# EAGLE board board (EAGLE 6.5.0)
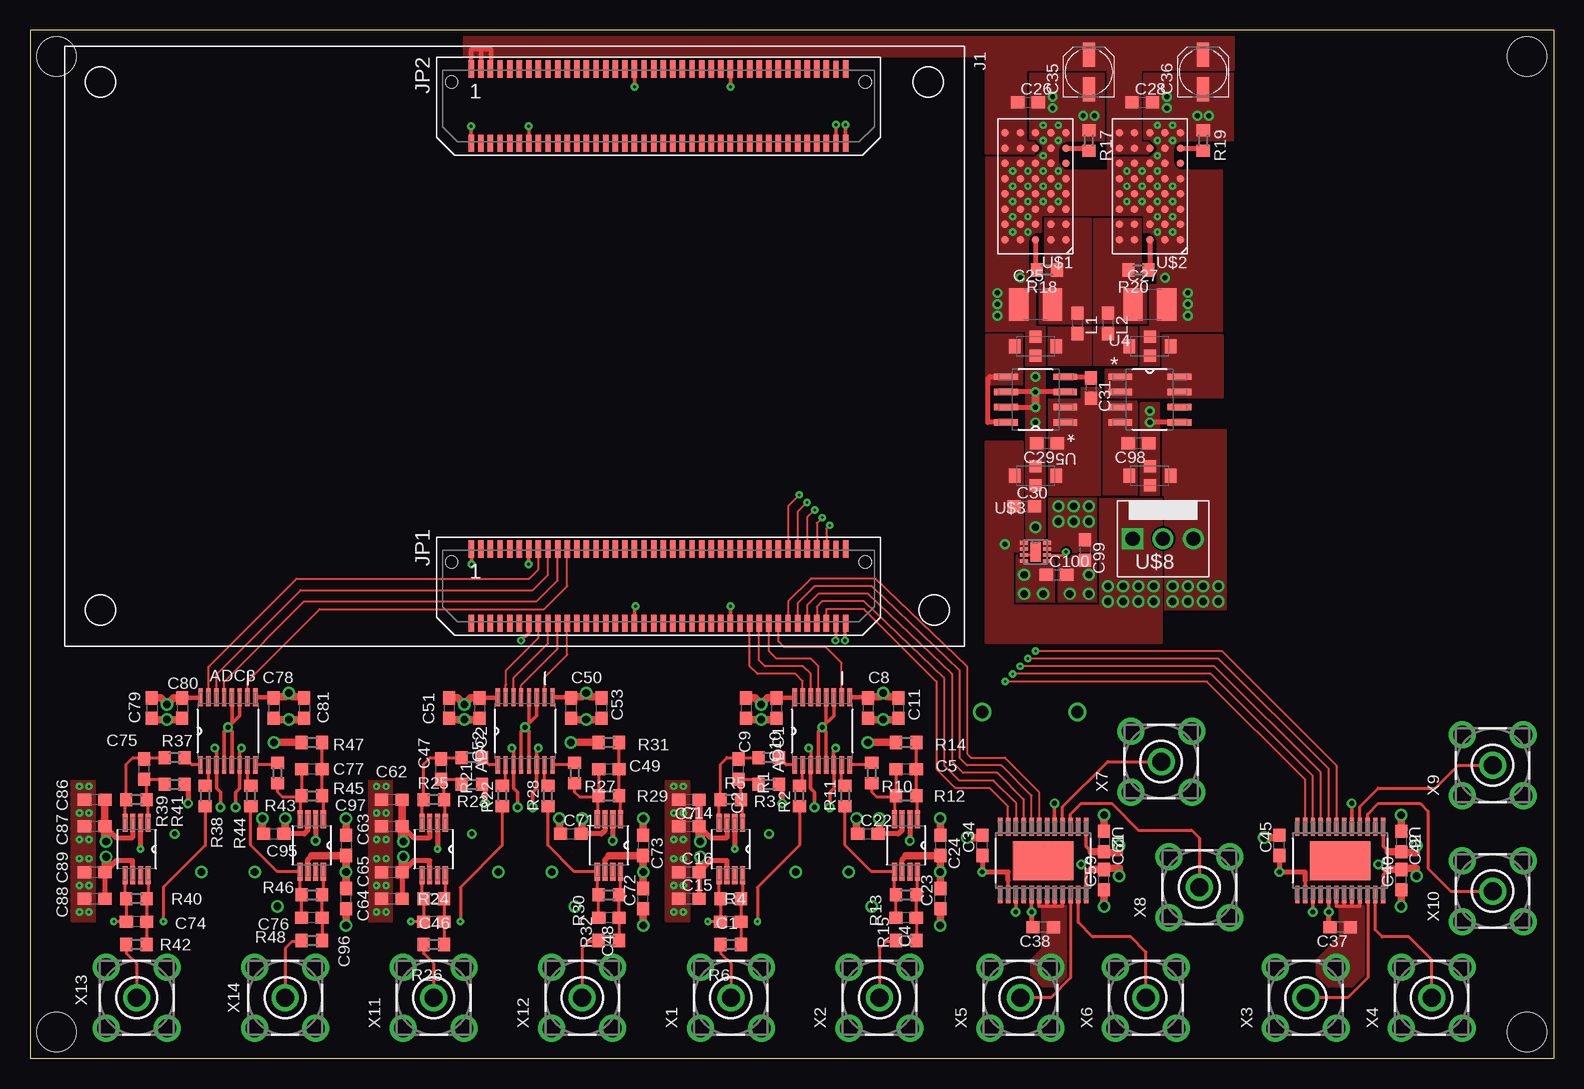
[diagram p4: board, top side]
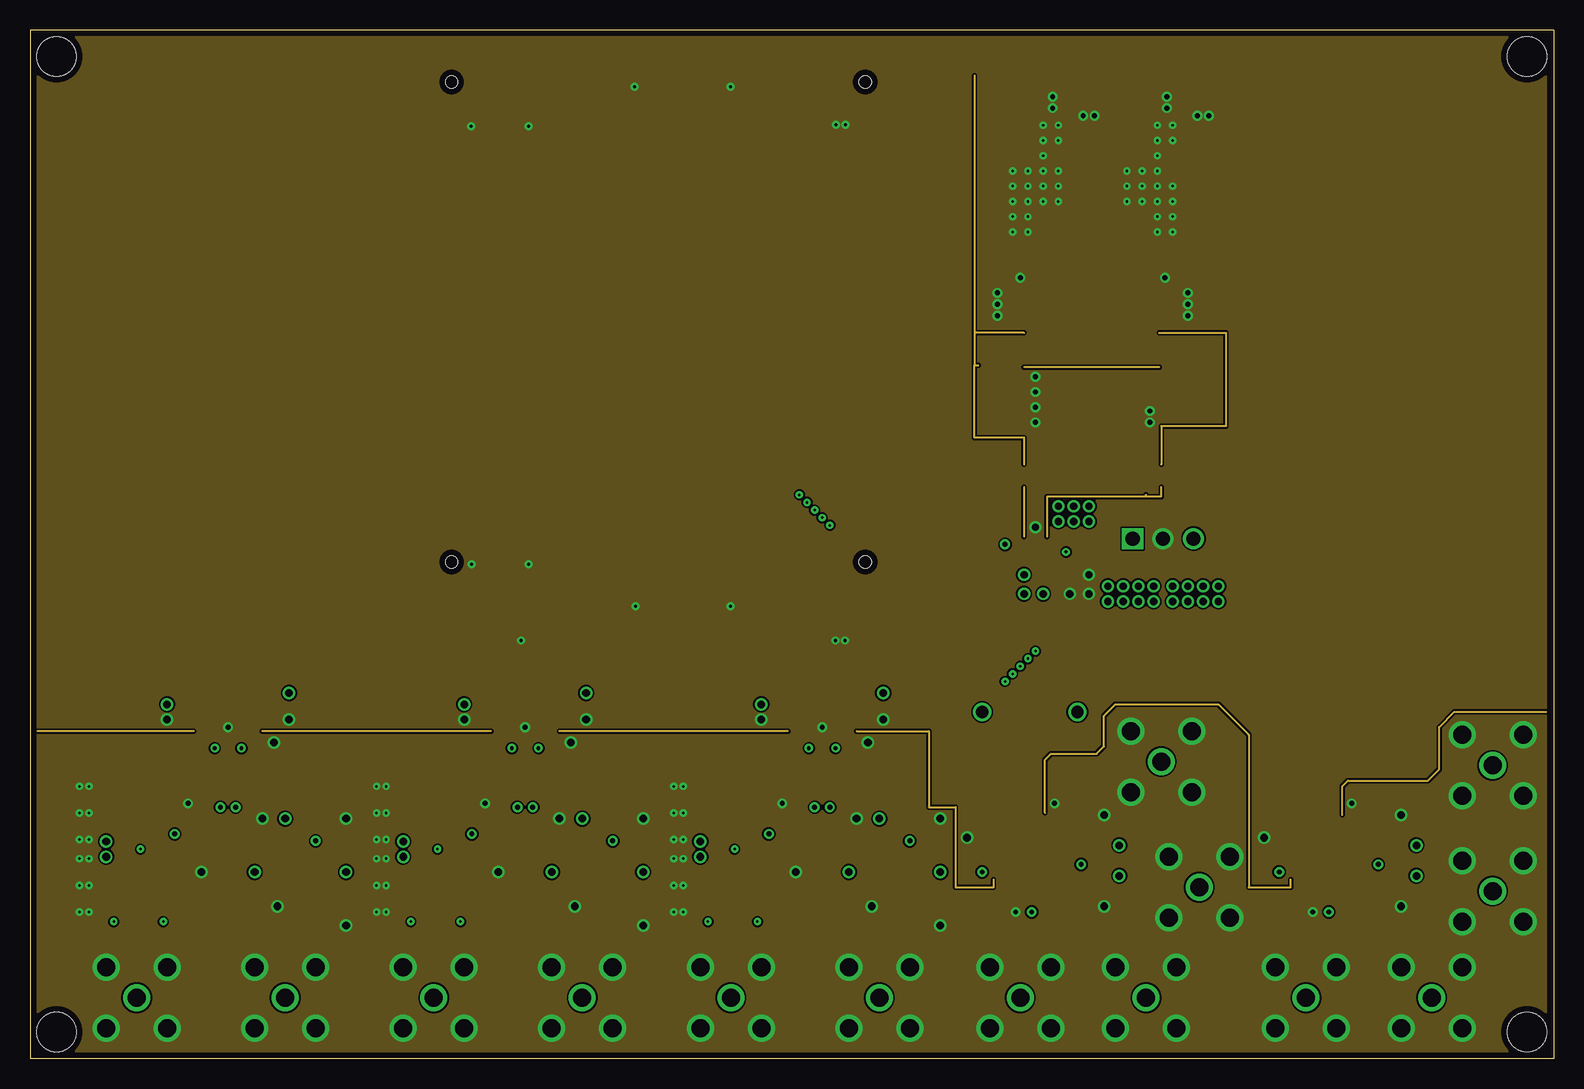
[diagram p5: board, inner layer $GND]
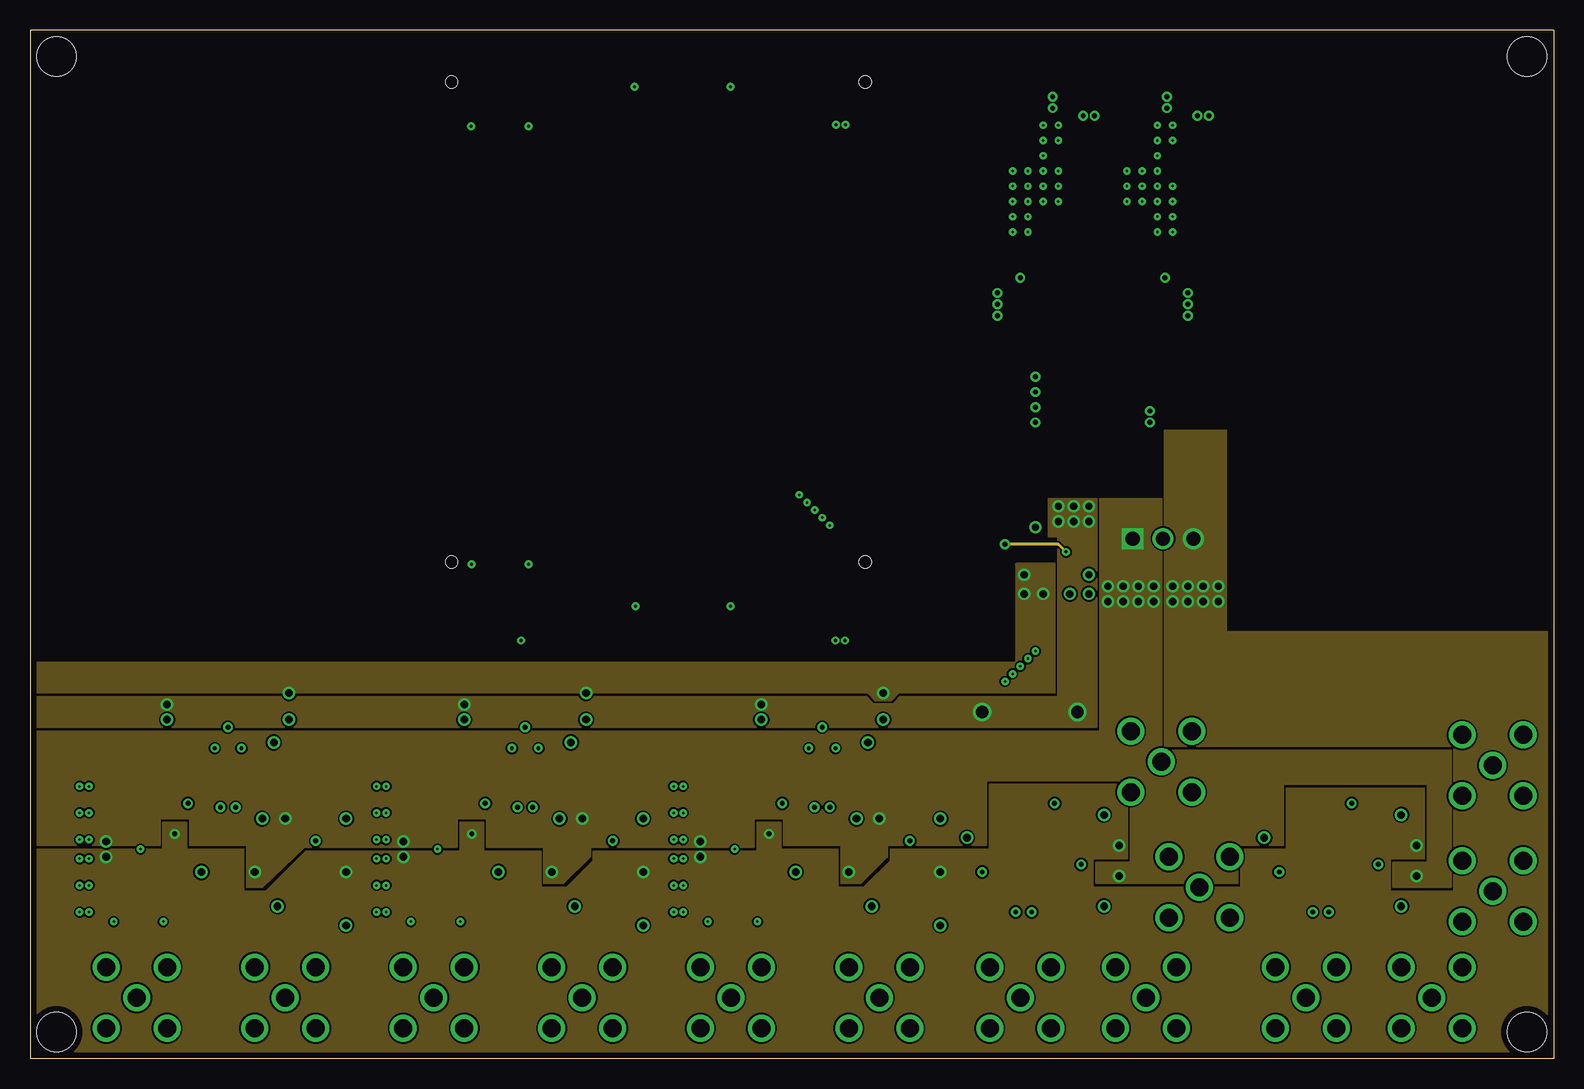
[diagram p6: board, inner layer Route15]
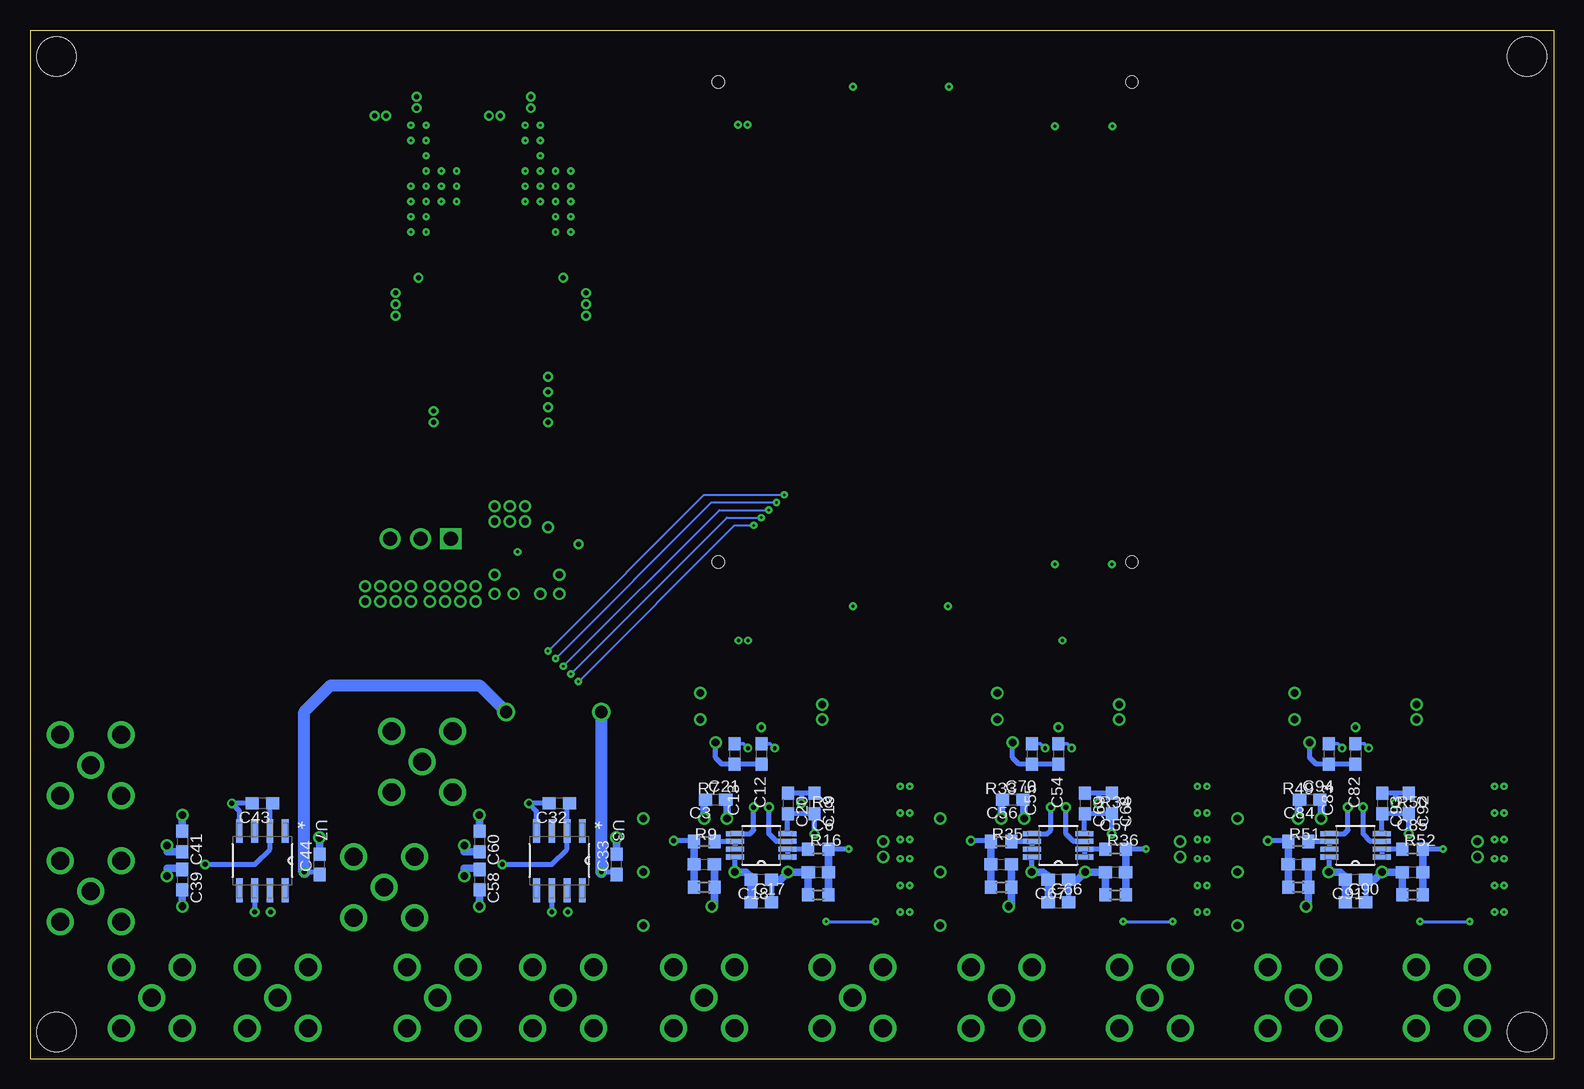
[diagram p7: board, bottom side, seen from below]

Size 127 x 85.72 mm. Coordinates in mm from the lower left corner, seen from the top.
Outline: 127,85.72 0,85.72 0,0 127,0 127,85.72
Copper layers (1+2*15+16): Top 0.0178mm / dielectric 12mil / $GND 0.0356mm / dielectric 28mil / Route15 0.0356mm / dielectric 12mil / Bottom 0.0178mm
Design rules "SSC-EAGLE-4Lyr_v1.0.0.3 *": minimum track width 6mil, minimum drill 8mil, track to track 6mil, track to pad 6mil, pad to pad 6mil, via to via 6mil, smd to smd 6mil, copper to edge 20mil, drill to drill 16mil, minimum pad ring 8mil, minimum via ring 8mil, stop-mask expansion 3mil, vias tented up to drill 0mil, thermal gap 0mil
Holes 3.26 mm at 124.78,2.22 124.78,83.5 2.22,83.5 2.22,2.22

## Footprints (pad centres in the part's own frame; a part is rotated, then mirrored left to right if it is on the bottom)
SOP65P640X120-16N = smd 1.473 x 0.356: 1 -2.819,2.286; 2 -2.819,1.626; 3 -2.819,0.965; 4 -2.819,0.33; 5 -2.819,-0.33; 6 -2.819,-0.965; 7 -2.819,-1.626; 8 -2.819,-2.286; 9 2.819,-2.286; 10 2.819,-1.626; 11 2.819,-0.965; 12 2.819,-0.33; 13 2.819,0.33; 14 2.819,0.965; 15 2.819,1.626; 16 2.819,2.286
SOP65P490X110-8N = smd 1.499 x 0.432: 1 -2.184,0.965; 2 -2.184,0.33; 3 -2.184,-0.33; 4 -2.184,-0.965; 5 2.184,-0.965; 6 2.184,-0.33; 7 2.184,0.33; 8 2.184,0.965
C0603 = smd 1.1 x 1: 1 -0.85,0; 2 0.85,0
C0603T = smd 1.1 x 1: + -0.85,0; - 0.85,0
C1210 = smd 1.6 x 2.7: 1 -1.4,0; 2 1.4,0
UD-4X5,8_NICHICON = smd 2 x 1: + 1.425,0; - -1.425,0
XEM6310 = smd 1.448 x 0.457: 101 -23.09,-15.6; 102 -16.92,-15.6; 103 -23.09,-14.8; 104 -16.92,-14.8; 105 -23.09,-14; 106 -16.92,-14; 107 -23.09,-13.2; 108 -16.92,-13.2; 109 -23.09,-12.4; 110 -16.92,-12.4; 111 -23.09,-11.6; 112 -16.92,-11.6; 113 -23.09,-10.8; 114 -16.92,-10.8; 115 -23.09,-10; 116 -16.92,-10; 117 -23.09,-9.2; 118 -16.92,-9.2; 119 -23.09,-8.4; 120 -16.92,-8.4; 121 -23.09,-7.6; 122 -16.92,-7.6; 123 -23.09,-6.8; 124 -16.92,-6.8; 125 -23.09,-6; 126 -16.92,-6; 127 -23.09,-5.2; 128 -16.92,-5.2; 129 -23.09,-4.4; 130 -16.92,-4.4; 131 -23.09,-3.6; 132 -16.92,-3.6; 133 -23.09,-2.8; 134 -16.92,-2.8; 135 -23.09,-2; 136 -16.92,-2; 137 -23.09,-1.2; 138 -16.92,-1.2; 139 -23.09,-0.4; 140 -16.92,-0.4; 141 -23.09,0.4; 142 -16.92,0.4; 143 -23.09,1.2; 144 -16.92,1.2; 145 -23.09,2; 146 -16.92,2; 147 -23.09,2.8; 148 -16.92,2.8; 149 -23.09,3.6; 150 -16.92,3.6; 151 -23.09,4.4; 152 -16.92,4.4; 153 -23.09,5.2; 154 -16.92,5.2; 155 -23.09,6; 156 -16.92,6; 157 -23.09,6.8; 158 -16.92,6.8; 159 -23.09,7.6; 160 -16.92,7.6; 161 -23.09,8.4; 162 -16.92,8.4; 163 -23.09,9.2; 164 -16.92,9.2; 165 -23.09,10; 166 -16.92,10; 167 -23.09,10.8; 168 -16.92,10.8; 169 -23.09,11.6; 170 -16.92,11.6; 171 -23.09,12.4; 172 -16.92,12.4; 173 -23.09,13.2; 174 -16.92,13.2; 175 -23.09,14; 176 -16.92,14; 177 -23.086,14.8; 178 -16.92,14.8; 179 -23.09,15.6; 180 -16.92,15.6; 201 16.91,-15.6; 202 23.08,-15.6; 203 16.91,-14.8; 204 23.08,-14.8; 205 16.91,-14; 206 23.08,-14; 207 16.91,-13.2; 208 23.08,-13.2; 209 16.91,-12.4; 210 23.08,-12.4; 211 16.91,-11.6; 212 23.08,-11.6; 213 16.91,-10.8; 214 23.08,-10.8; 215 16.91,-10; 216 23.08,-10; 217 16.91,-9.2; 218 23.08,-9.2; 219 16.91,-8.4; 220 23.08,-8.4; 221 16.91,-7.6; 222 23.08,-7.6; 223 16.91,-6.8; 224 23.08,-6.8; 225 16.91,-6; 226 23.08,-6; 227 16.91,-5.2; 228 23.08,-5.2; 229 16.91,-4.4; 230 23.08,-4.4; 231 16.91,-3.6; 232 23.08,-3.6; 233 16.91,-2.8; 234 23.08,-2.8; 235 16.91,-2; 236 23.08,-2; 237 16.91,-1.2; 238 23.08,-1.2; 239 16.91,-0.4; 240 23.08,-0.4; 241 16.91,0.4; 242 23.08,0.4; 243 16.91,1.2; 244 23.08,1.2; 245 16.91,2; 246 23.08,2; 247 16.91,2.8; 248 23.08,2.8; 249 16.91,3.6; 250 23.08,3.6; 251 16.91,4.4; 252 23.08,4.4; 253 16.91,5.2; 254 23.08,5.2; 255 16.91,6; 256 23.08,6; 257 16.91,6.8; 258 23.08,6.8; 259 16.91,7.6; 260 23.08,7.6; 261 16.91,8.4; 262 23.08,8.4; 263 16.91,9.2; 264 23.08,9.2; 265 16.91,10; 266 23.08,10; 267 16.91,10.8; 268 23.08,10.8; 269 16.91,11.6; 270 23.08,11.6; 271 16.91,12.4; 272 23.08,12.4; 273 16.91,13.2; 274 23.08,13.2; 275 16.91,14; 276 23.08,14; 277 16.914,14.8; 278 23.08,14.8; 279 16.91,15.6; 280 23.08,15.6 | hole 1.016: -22.032,-17.238; -22.032,17.238; 17.968,-17.238; 17.968,17.238
R0603 = smd 1 x 1.1: 1 -0.85,0; 2 0.85,0
SOP65P640X120-25N = smd 1.473 x 0.356: 1 -2.819,3.581; 2 -2.819,2.921; 3 -2.819,2.286; 4 -2.819,1.626; 5 -2.819,0.965; 6 -2.819,0.33; 7 -2.819,-0.33; 8 -2.819,-0.965; 9 -2.819,-1.626; 10 -2.819,-2.286; 11 -2.819,-2.921; 12 -2.819,-3.581; 13 2.819,-3.581; 14 2.819,-2.921; 15 2.819,-2.286; 16 2.819,-1.626; 17 2.819,-0.965; 18 2.819,-0.33; 19 2.819,0.33; 20 2.819,0.965; 21 2.819,1.626; 22 2.819,2.286; 23 2.819,2.921; 24 2.819,3.581 | smd 3.251 x 5.029: 25 0,0
SOIC127P600X175-8N = smd 1.981 x 0.559: 1 -2.464,1.905; 2 -2.464,0.635; 3 -2.464,-0.635; 4 -2.464,-1.905; 5 2.464,-1.905; 6 2.464,-0.635; 7 2.464,0.635; 8 2.464,1.905
SOIC127P600X175-8N' = smd 1.981 x 0.533: 1 -2.464,1.905; 2 -2.464,0.635; 3 -2.464,-0.635; 4 -2.464,-1.905; 5 2.464,-1.905; 6 2.464,-0.635; 7 2.464,0.635; 8 2.464,1.905
BGA-40 = smd 0.635 x 0.635: A1 -2.54,4.445; A2 -1.27,4.445; A3 0,4.445; A4 1.27,4.445; A5 2.54,4.445; B1 -2.54,3.175; B2 -1.27,3.175; B3 0,3.175; B4 1.27,3.175; B5 2.54,3.175; C1 -2.54,1.905; C2 -1.27,1.905; C3 0,1.905; C4 1.27,1.905; C5 2.54,1.905; D1 -2.54,0.635; D2 -1.27,0.635; D3 0,0.635; D4 1.27,0.635; D5 2.54,0.635; E1 -2.54,-0.635; E2 -1.27,-0.635; E3 0,-0.635; E4 1.27,-0.635; E5 2.54,-0.635; F1 -2.54,-1.905; F2 -1.27,-1.905; F3 0,-1.905; F4 1.27,-1.905; F5 2.54,-1.905; G1 -2.54,-3.175; G2 -1.27,-3.175; G3 0,-3.175; G4 1.27,-3.175; G5 2.54,-3.175; H1 -2.54,-4.445; H2 -1.27,-4.445; H3 0,-4.445; H4 1.27,-4.445; H5 2.54,-4.445
QFN50P200X200X60-9N = smd 0.66 x 0.305: 1 -0.965,0.762; 2 -0.965,0.254; 3 -0.965,-0.254; 4 -0.965,-0.762; 5 0.965,-0.762; 6 0.965,-0.254; 7 0.965,0.254; 8 0.965,0.762 | smd 0.889 x 1.6: 9 0,0
NFM31P = smd 1 x 1: GND 0,0.8; GND2 0,-0.8 | smd 0.95 x 1.2: IN -1.725,0; OUT 1.725,0
KK-V-3 = drill 1.168 square: 1 0,2.54 | drill 1.168: 2 0,0; 3 0,-2.54
LTI-SASF54GT = drill 1.5 pad 2.2: 1 0,0; 2 -2.54,2.54; 3 2.54,2.54; 4 2.54,-2.54; 5 -2.54,-2.54

## Placement (x,y rotation side)
ADC1  AD7357BRUZ  [SOP65P640X120-16N]  66.04,27.3 90 top
ADC2  AD7357BRUZ  [SOP65P640X120-16N]  41.27,27.3 90 top
ADC3  AD7357BRUZ  [SOP65P640X120-16N]  16.51,27.3 90 top
ADCOP1  AD8138ARMZ  [SOP65P490X110-8N]  58.42,17.46 270 top
ADCOP2  AD8138ARMZ  [SOP65P490X110-8N]  73.03,17.78 270 top
ADCOP3  AD8138ARMZ  [SOP65P490X110-8N]  33.66,17.46 270 top
ADCOP4  AD8138ARMZ  [SOP65P490X110-8N]  48.26,17.78 270 top
ADCOP5  AD8138ARMZ  [SOP65P490X110-8N]  8.89,17.46 270 top
ADCOP6  AD8138ARMZ  [SOP65P490X110-8N]  23.5,17.78 270 top
C1  39pF  [C0603]  58.42,11.43 180 top
C2  39pF  [C0603]  59.05,24.13 90 top
C3  0.1uF  [C0603]  70.8,16.19 0 bottom
C4  39pF  [C0603]  73.03,11.75 180 top
C5  39pF  [C0603]  73.03,24.13 180 top
C6  0.1uF  [C0603]  61.28,15.56 0 bottom
C7  10uF  [C0603T]  54.93,21.59 180 top
C8  10uF  [C0603T]  69.85,29.21 270 top
C9  10uF  [C0603T]  59.69,29.21 270 top
C10  0.1uF  [C0603]  62.23,29.21 270 top
C11  0.1uF  [C0603]  72.39,29.21 270 top
C12  10uF  [C0603T]  66.04,25.4 270 bottom
C13  10uF  [C0603T]  68.26,25.4 270 bottom
C14  0.1uF  [C0603]  54.93,19.37 0 top
C15  10uF  [C0603T]  54.93,13.34 0 top
C16  0.1uF  [C0603]  54.93,15.56 0 top
C17  10uF  [C0603T]  66.04,13.02 0 bottom
C18  0.1uF  [C0603]  66.04,14.92 180 bottom
C19  10uF  [C0603T]  61.59,21.27 270 bottom
C20  0.1uF  [C0603]  63.82,21.27 270 bottom
C21  10uF  [C0603T]  69.85,21.59 0 bottom
C22  0.1uF  [C0603]  69.85,18.73 0 top
C23  10uF  [C0603T]  75.88,13.34 90 top
C24  0.1uF  [C0603]  75.88,17.78 270 top
C25  100uF  [C1210]  83.82,62.87 0 top
C26  4.7uF  [C0603]  83.19,79.69 0 top
C27  100uF  [C1210]  93.34,62.87 0 top
C28  4.7uF  [C0603]  92.71,79.69 0 top
C29  10uF <3Ohm ESR  [C0603T]  84.77,51.28 180 top
C30  4.7uF  [C0603]  82.87,46.04 0 top
C31  0.01uF  [C0603]  88.42,55.88 270 top
C32  0.1uF  [C0603]  82.87,21.27 180 bottom
C33  10uF  [C0603T]  78.11,16.19 90 bottom
C34  0.1uF  [C0603]  79.38,17.78 90 top
C35  47uF  [UD-4X5,8_NICHICON]  88.27,82.23 90 top
C36  47uF  [UD-4X5,8_NICHICON]  97.79,82.23 90 top
C37  0.1uF  [C0603]  109.22,10.95 180 top
C38  0.1uF  [C0603]  84.45,10.95 180 top
C39  10uF  [C0603T]  114.3,14.92 270 bottom
C40  0.1uF  [C0603]  114.3,14.92 90 top
C41  10uF  [C0603T]  114.3,18.1 270 bottom
C42  0.1uF  [C0603]  114.3,18.1 270 top
C43  0.1uF  [C0603]  107.63,21.27 180 bottom
C44  10uF  [C0603T]  102.87,16.19 90 bottom
C45  0.1uF  [C0603]  104.14,17.78 90 top
C46  39pF  [C0603]  33.66,11.43 180 top
C47  39pF  [C0603]  34.29,24.13 90 top
C48  39pF  [C0603]  48.26,11.75 180 top
C49  39pF  [C0603]  48.26,24.13 180 top
C50  10uF  [C0603T]  45.09,29.21 270 top
C51  10uF  [C0603T]  34.92,29.21 270 top
C52  0.1uF  [C0603]  37.47,29.21 270 top
C53  0.1uF  [C0603]  47.62,29.21 270 top
C54  10uF  [C0603T]  41.27,25.4 270 bottom
C55  10uF  [C0603T]  43.5,25.4 270 bottom
C56  0.1uF  [C0603]  46.04,16.19 0 bottom
C57  0.1uF  [C0603]  36.51,15.56 0 bottom
C58  10uF  [C0603T]  89.53,14.92 270 bottom
C59  0.1uF  [C0603]  89.53,14.92 90 top
C60  10uF  [C0603T]  89.53,18.1 270 bottom
C61  0.1uF  [C0603]  89.53,18.1 270 top
C62  10uF  [C0603T]  30.16,21.59 180 top
C63  0.1uF  [C0603]  30.16,19.37 0 top
C64  10uF  [C0603T]  30.16,13.34 0 top
C65  0.1uF  [C0603]  30.16,15.56 0 top
C66  10uF  [C0603T]  41.27,13.02 0 bottom
C67  0.1uF  [C0603]  41.27,14.92 180 bottom
C68  10uF  [C0603T]  36.83,21.27 270 bottom
C69  0.1uF  [C0603]  39.05,21.27 270 bottom
C70  10uF  [C0603T]  45.09,21.59 0 bottom
C71  0.1uF  [C0603]  45.09,18.73 0 top
C72  10uF  [C0603T]  51.12,13.34 90 top
C73  0.1uF  [C0603]  51.12,17.78 270 top
C74  39pF  [C0603]  8.89,11.43 180 top
C75  39pF  [C0603]  9.53,24.13 90 top
C76  39pF  [C0603]  23.5,11.75 180 top
C77  39pF  [C0603]  23.5,24.13 180 top
C78  10uF  [C0603T]  20.32,29.21 270 top
C79  10uF  [C0603T]  10.16,29.21 270 top
C80  0.1uF  [C0603]  12.7,29.21 270 top
C81  0.1uF  [C0603]  22.86,29.21 270 top
C82  10uF  [C0603T]  16.51,25.4 270 bottom
C83  10uF  [C0603T]  18.73,25.4 270 bottom
C84  0.1uF  [C0603]  21.27,16.19 0 bottom
C85  0.1uF  [C0603]  11.75,15.56 0 bottom
C86  10uF  [C0603T]  5.4,21.59 180 top
C87  0.1uF  [C0603]  5.4,19.37 0 top
C88  10uF  [C0603T]  5.4,13.34 0 top
C89  0.1uF  [C0603]  5.4,15.56 0 top
C90  10uF  [C0603T]  16.51,13.02 0 bottom
C91  0.1uF  [C0603]  16.51,14.92 180 bottom
C92  10uF  [C0603T]  12.06,21.27 270 bottom
C93  0.1uF  [C0603]  14.29,21.27 270 bottom
C94  10uF  [C0603T]  20.32,21.59 0 bottom
C95  0.1uF  [C0603]  20.32,18.73 0 top
C96  10uF  [C0603T]  26.35,13.34 90 top
C97  0.1uF  [C0603]  26.35,17.78 270 top
C98  1uF Tant  [C0603T]  92.39,51.28 180 top
C99  4.7uF  [C0603]  87.95,42.39 270 top
C100  4.7uF  [C0603]  85.57,40.32 0 top
J1  XEM6310  [XEM6310]  52.39,59.37 270 top
L1  MPZ1608S601A  [C0603]  87.31,61.28 270 top
L2  MPZ1608S601A  [C0603]  89.85,61.28 270 top
R1  33  [R0603]  61.59,25.08 0 top
R2  33  [R0603]  64.14,21.91 90 top
R3  499  [R0603]  58.42,21.59 180 top
R4  499  [R0603]  58.42,13.34 180 top
R5  499  [R0603]  61.59,22.86 180 top
R6  499  [R0603]  58.42,9.53 0 top
R7  10K  [R0603]  70.8,18.1 180 bottom
R8  10K  [R0603]  61.28,17.46 0 bottom
R9  10K  [R0603]  70.8,14.29 0 bottom
R10  33  [R0603]  70.17,23.81 90 top
R11  33  [R0603]  67.94,21.91 90 top
R12  499  [R0603]  73.03,21.91 180 top
R13  499  [R0603]  73.03,13.65 180 top
R14  499  [R0603]  73.03,26.35 0 top
R15  499  [R0603]  73.03,9.84 0 top
R16  10K  [R0603]  61.28,13.65 0 bottom
R17  115k  [R0603]  88.27,76.52 270 top
R18  51k  [R0603]  84.77,65.72 180 top
R19  130k  [R0603]  97.79,76.52 270 top
R20  66k  [R0603]  92.39,65.72 180 top
R21  33  [R0603]  36.83,25.08 0 top
R22  33  [R0603]  39.37,21.91 90 top
R23  499  [R0603]  33.66,21.59 180 top
R24  499  [R0603]  33.66,13.34 180 top
R25  499  [R0603]  36.83,22.86 180 top
R26  499  [R0603]  33.66,9.53 0 top
R27  33  [R0603]  45.4,23.81 90 top
R28  33  [R0603]  43.18,21.91 90 top
R29  499  [R0603]  48.26,21.91 180 top
R30  499  [R0603]  48.26,13.65 180 top
R31  499  [R0603]  48.26,26.35 0 top
R32  499  [R0603]  48.26,9.84 0 top
R33  10K  [R0603]  46.04,18.1 180 bottom
R34  10K  [R0603]  36.51,17.46 0 bottom
R35  10K  [R0603]  46.04,14.29 0 bottom
R36  10K  [R0603]  36.51,13.65 0 bottom
R37  33  [R0603]  12.06,25.08 0 top
R38  33  [R0603]  14.61,21.91 90 top
R39  499  [R0603]  8.89,21.59 180 top
R40  499  [R0603]  8.89,13.34 180 top
R41  499  [R0603]  12.06,22.86 180 top
R42  499  [R0603]  8.89,9.53 0 top
R43  33  [R0603]  20.64,23.81 90 top
R44  33  [R0603]  18.41,21.91 90 top
R45  499  [R0603]  23.5,21.91 180 top
R46  499  [R0603]  23.5,13.65 180 top
R47  499  [R0603]  23.5,26.35 0 top
R48  499  [R0603]  23.5,9.84 0 top
R49  10K  [R0603]  21.27,18.1 180 bottom
R50  10K  [R0603]  11.75,17.46 0 bottom
R51  10K  [R0603]  21.27,14.29 0 bottom
R52  10K  [R0603]  11.75,13.65 0 bottom
U1  AD8022ARMZ  [SOP65P490X110-8N]  66.04,17.78 180 bottom
U2  AD5754BREZ  [SOP65P640X120-25N]  84.45,16.51 270 top
U3  ADR420ARZ  [SOIC127P600X175-8N]  82.87,16.51 270 bottom
U4  LT1175CS8-5PBF  [SOIC127P600X175-8N']  93.34,54.93 0 top
U5  LT1763CS8-5PBF  [SOIC127P600X175-8N']  83.82,54.93 180 top
U6  AD5754BREZ  [SOP65P640X120-25N]  109.22,16.51 270 top
U7  ADR420ARZ  [SOIC127P600X175-8N]  107.63,16.51 270 bottom
U8  AD8022ARMZ  [SOP65P490X110-8N]  41.27,17.78 180 bottom
U9  AD8022ARMZ  [SOP65P490X110-8N]  16.51,17.78 180 bottom
U$1  LTM8045  [BGA-40]  83.82,72.71 180 top
U$2  LTM8045  [BGA-40]  93.34,72.71 180 top
U$3  ADP222ACPZ-3325-R7  [QFN50P200X200X60-9N]  83.82,42.23 0 top
U$4  NFM31P  [NFM31P]  83.82,59.37 180 top
U$5  NFM31P  [NFM31P]  93.34,59.37 0 top
U$6  NFM31P  [NFM31P]  93.34,48.58 0 top
U$7  NFM31P  [NFM31P]  83.82,48.58 180 top
U$8  KK3V  [KK-V-3]  94.46,43.34 90 top
X1  LTI-SASF54GT  [LTI-SASF54GT]  58.42,5.08 90 top
X2  LTI-SASF54GT  [LTI-SASF54GT]  70.8,5.08 90 top
X3  LTI-SASF54GT  [LTI-SASF54GT]  106.36,5.08 90 top
X4  LTI-SASF54GT  [LTI-SASF54GT]  116.84,5.08 90 top
X5  LTI-SASF54GT  [LTI-SASF54GT]  82.55,5.08 90 top
X6  LTI-SASF54GT  [LTI-SASF54GT]  93.03,5.08 90 top
X7  LTI-SASF54GT  [LTI-SASF54GT]  94.3,24.77 90 top
X8  LTI-SASF54GT  [LTI-SASF54GT]  97.47,14.29 90 top
X9  LTI-SASF54GT  [LTI-SASF54GT]  121.92,24.45 90 top
X10  LTI-SASF54GT  [LTI-SASF54GT]  121.92,13.97 90 top
X11  LTI-SASF54GT  [LTI-SASF54GT]  33.66,5.08 90 top
X12  LTI-SASF54GT  [LTI-SASF54GT]  46.04,5.08 90 top
X13  LTI-SASF54GT  [LTI-SASF54GT]  8.89,5.08 90 top
X14  LTI-SASF54GT  [LTI-SASF54GT]  21.27,5.08 90 top

## Tracks (layer width: path | path; a pad name or v marks a point on that pad's centre or on a via)
+3V3  (via drill 0.41, 0.61, 0.64, 1.02)
  Top 0.305: U2.14 81.53,14.86 | U6.14 106.3,14.86
  Top 0.356: C10.1 63.75,30.06 ADC1.16 | C52.1 38.99,30.06 ADC2.16 | C80.1 14.22,30.06 ADC3.16
  Top 0.406: 81.53,14.86 81.53,15.56 v79.38,15.56 C34.1 | 106.3,14.86 106.3,15.56 v104.14,15.56 C45.1
  Top 0.61: C10.1 61.49,30.06 v60.96,29.53 60.43,30.06 C9.+ | C52.1 36.73,30.06 v36.2,29.53 35.66,30.06 C51.+ | C80.1 11.96,30.06 v11.43,29.53 10.9,30.06 C79.+
  Route15 0.406: 79.38,15.5 v79.38,15.56
  Bottom 0.406: C33.+ 78.32,15.56 v79.38,15.56 | C44.+ 103.08,15.56 v104.14,15.56
  Bottom 1.016: v79.38,15.56 v79.38,28.89 | v104.14,15.56 104.14,28.89 101.92,31.11 89.53,31.11 v87.31,28.89
  other vias: 87,46.04 85.72,44.77 88.27,46.04 88.27,44.77 87,44.77 85.72,46.04
  pour Top: 88.9,46.67 84.93,46.67 84.93,43.18 84.45,43.18 84.45,42.23 88.9,42.23
  pour Route15 (rank 2): 88.9,46.67 88.9,27.62 0.32,27.62 0.32,30.16 85.72,30.16 85.72,43.5 84.93,43.5 84.93,46.67
+5V  (via drill 0.25, 0.41, 0.61, 0.64)
  Top 0.254: U$3.6 86.11,41.97 v86.36,42.23
  Top 0.305: U2.24 88.04,15.33 88.27,15.56 | 89.43,15.88 C59.2 | 88.27,15.56 88.48,15.77 | v87.63,16.19 88.27,15.56 | U6.24 112.8,15.33 113.03,15.56 | 114.2,15.88 C40.2 | 113.03,15.56 113.25,15.77 | v112.39,16.19 113.03,15.56
  Top 0.406: ADCOP2.3 72.69,19.04 72.39,18.73 C22.2 70.8,18.63 | C14.2 56.73,18.41 58.09,18.41 ADCOP1.3 | ADCOP4.3 47.93,19.04 47.62,18.73 C71.2 46.04,18.63 | C63.2 31.96,18.41 33.33,18.41 ADCOP3.3 | ADCOP6.3 23.16,19.04 22.86,18.73 C95.2 21.27,18.63 | C87.2 7.2,18.41 8.56,18.41 ADCOP5.3
  Top 0.61: v70.8,20 70.8,18.63 | C7.+ C14.2 55.56,19.37 | 88.48,15.77 C59.2 89.64,15.88 90.81,15.88 v90.81,15.24 | v46.04,20 46.04,18.63 | C62.+ C63.2 30.8,19.37 | v21.27,20 21.27,18.63 | C86.+ C87.2 6.03,19.37 | 113.25,15.77 C40.2 114.4,15.88 115.57,15.88 v115.57,15.24
  Top 0.813: v55.88,18.1 55.88,19.37 C14.2 | v31.11,18.1 31.11,19.37 C63.2 | v6.35,18.1 6.35,19.37 C87.2
  Route15 0.254: v81.28,42.86 85.72,42.86 v86.36,42.23
  Bottom 0.406: v68.26,15.56 68.22,15.88 U1.8 | v87.63,16.19 83.5,16.19 82.23,17.46 U3.2 82.23,21.27 C32.1 | v43.5,15.56 43.46,15.88 U8.8 | v18.73,15.56 18.69,15.88 U9.8 | v112.39,16.19 108.27,16.19 107,17.46 U7.2 107,21.27 C43.1
  Bottom 0.61: v68.26,15.56 67.31,15.56 66.89,15.18 C18.2 C17.+ | C59.2 89.53,15.88 90.81,15.88 v90.81,15.24 | v70.8,20 70.8,21.59 C21.+ | v43.5,15.56 42.55,15.56 42.12,15.18 C67.2 C66.+ | v46.04,20 46.04,21.59 C70.+ | v18.73,15.56 17.78,15.56 17.36,15.18 C91.2 C90.+ | v21.27,20 21.27,21.59 C94.+ | C40.2 114.3,15.88 115.57,15.88 v115.57,15.24
  other vias: 92.39,39.37 89.85,39.37 92.39,38.1 89.85,38.1 91.12,38.1 91.12,39.37 93.66,38.1 93.66,39.37
  pour Top: 82.71,51.44 82.71,43.18 83.19,43.18 83.19,42.23 81.92,42.23 81.92,37.78 89.22,37.78 89.22,46.67 94.3,46.67 94.3,34.61 79.69,34.61 79.69,51.44
  pour Route15: 0.32,17.78 0.32,27.3 89.22,27.3 89.22,46.67 94.3,46.67 94.3,25.72 118.43,25.72 118.43,14.29 113.67,14.29 113.67,16.35 116.52,16.35 116.52,22.86 104.46,22.86 104.46,17.78 100.65,17.78 100.65,14.61 88.9,14.61 88.9,16.35 91.76,16.35 91.76,23.18 79.69,23.18 79.69,17.78 71.44,17.78 71.44,16.83 69.22,14.61 67.63,14.61 67.63,17.78 62.87,17.78 62.87,20 60.33,20 60.33,17.62 46.67,17.62 46.67,16.83 44.45,14.61 42.86,14.61 42.86,17.62 38.1,17.62 38.1,20 35.56,20 35.56,17.62 22.86,17.62 19.37,14.29 18.1,14.29 18.1,17.78 13.34,17.78 13.34,20 10.79,20 10.79,17.78
-5V  (via drill 0.41, 0.61, 0.64, 0.64 pad 0.61)
  Top 0.305: U2.1 88.04,17.69 88.48,17.25 | U6.1 112.8,17.69 113.25,17.25
  Top 0.406: ADCOP2.6 72.69,16.6 73.03,16.93 | C15.- C16.2 56.73,16.51 58.09,16.51 ADCOP1.6 | ADCOP4.6 47.93,16.6 48.26,16.93 | C64.- C65.2 31.96,16.51 33.33,16.51 ADCOP3.6 | ADCOP6.6 23.16,16.6 23.5,16.93 | C88.- C89.2 7.2,16.51 8.56,16.51 ADCOP5.6
  Top 0.61: C24.2 75.98,16.73 | C23.- v75.88,15.56 C24.2 | C24.2 73.03,16.93 | 88.48,17.25 C61.2 89.53,17.14 90.81,17.14 v90.81,17.78 | C73.2 51.22,16.73 | C72.- v51.12,15.56 C73.2 | C73.2 48.26,16.93 | C97.2 26.45,16.73 | C96.- v26.35,15.56 C97.2 | C97.2 23.5,16.93 | 113.25,17.25 C42.2 114.3,17.14 115.57,17.14 v115.57,17.78
  Top 0.813: v55.88,16.83 55.88,15.56 C16.2 | v31.11,16.83 31.11,15.56 C65.2 | v6.35,16.83 6.35,15.56 C89.2
  Bottom 0.406: v61.59,18.73 C19.- C20.2 63.86,20.38 U1.4 | v36.83,18.73 C68.- C69.2 39.09,20.38 U8.4 | v12.06,18.73 C92.- C93.2 14.33,20.38 U9.4
  Bottom 0.61: v90.81,17.78 90.81,17.25 C61.2 | v115.57,17.78 115.57,17.25 C42.2
  other vias: 99.06,38.1 96.52,38.1 97.79,39.37 95.25,39.37 96.52,39.37 95.25,38.1 99.06,39.37 97.79,38.1
  pour Top: 94.46,52.39 94.46,46.99 94.61,46.99 94.61,37.47 99.69,37.47 99.69,52.39
  pour Route15: 71.75,16.51 71.75,17.46 80.01,17.46 80.01,22.86 91.44,22.86 91.44,16.67 88.58,16.67 88.58,14.29 100.97,14.29 100.97,17.46 104.78,17.46 104.78,22.54 116.2,22.54 116.2,16.67 113.35,16.67 113.35,13.97 118.75,13.97 118.75,26.04 94.61,26.04 94.61,52.39 99.69,52.39 99.69,35.56 126.68,35.56 126.68,0.32 0.32,0.32 0.32,17.46 11.11,17.46 11.11,19.68 13.02,19.68 13.02,17.46 17.78,17.46 17.78,13.97 19.68,13.97 23.02,17.3 35.88,17.3 35.88,19.68 37.78,19.68 37.78,17.3 42.55,17.3 42.55,14.29 44.77,14.29 46.99,16.51 46.99,17.3 60.64,17.3 60.64,19.68 62.55,19.68 62.55,17.46 67.31,17.46 67.31,14.29 69.53,14.29
ADC0
  Top 0.152: ADC1.10 67.67,32.98 66.36,34.29 62.87,34.29 62.39,34.77 J1.266
ADC1
  Top 0.152: ADC1.13 65.71,32.72 65.09,33.34 62.23,33.34 61.59,33.97 J1.264
ADC2
  Top 0.152: 65.09,30.14 65.09,32.07 64.45,32.7 61.28,32.7 60.79,33.19 J1.262
  Top 0.254: ADC1.14 65.09,30.14
ADC3
  Top 0.152: ADC1.15 64.41,31.47 63.82,32.07 60.64,32.07 59.99,32.72 J1.260
ADC7
  Top 0.152: ADC2.10 42.9,31.79 44.79,33.67 J1.222
ADC8
  Top 0.152: ADC2.13 40.95,31.13 43.99,34.17 J1.220
ADC9
  Top 0.152: 40.32,30.14 40.32,31.75 43.19,34.62 J1.218
  Top 0.254: ADC2.14 40.32,30.14
ADC10
  Top 0.152: ADC2.15 39.65,31.15 39.69,31.19 39.69,32.38 42.39,35.09 J1.216
ADC11
  Top 0.152: ADC3.10 18.14,31.47 24.13,37.47 42.86,37.47 44.79,39.39 J1.221
ADC12
  Top 0.152: ADC3.13 16.18,31.42 22.86,38.1 42.23,38.1 43.99,39.86 J1.219
ADC13
  Top 0.152: ADC3.14 15.54,32.05 22.54,39.05 41.91,39.05 43.18,40.32 J1.217
ADC14
  Top 0.152: ADC3.15 14.88,32.66 22.23,40.01 41.59,40.01 42.39,40.8 J1.215
DACD0
  Top 0.152: U2.7 84.12,22.24 81.28,25.08 78.42,25.08 78.11,25.4 78.11,32.7 70.48,40.01 65.09,40.01 63.19,38.1 J1.268
DACD1
  Top 0.152: U2.8 83.49,21.92 80.96,24.45 78.11,24.45 77.47,25.08 77.47,32.38 70.17,39.37 65.41,39.37 63.99,37.95 J1.270
DACD2
  Top 0.152: J1.272 64.79,37.8 65.72,38.73 69.85,38.73 76.83,32.07 76.83,24.77 77.79,23.81 80.64,23.81 82.83,21.63 U2.9
DACD3
  Top 0.152: J1.274 65.59,37.65 66.04,38.1 69.53,38.1 76.2,31.75 76.2,24.45 77.47,23.18 80.33,23.18 82.17,21.34 U2.10
DACD4
  Top 0.152: U2.11 81.53,21.02 80.01,22.54 77.15,22.54 75.56,24.13 75.56,31.43 69.53,37.47 66.36,37.47 66.36,36.32 J1.276
DACD5  (via drill 0.2)
  Top 0.152: U6.7 108.89,24.46 99.38,33.97 v83.82,33.97 | v64.14,46.99 63.19,46.04 J1.267
  Bottom 0.152: v64.14,46.99 70.8,46.99 v83.82,33.97
DACD6  (via drill 0.2)
  Top 0.152: U6.8 108.25,24.14 99.06,33.34 v83.19,33.34 | v64.77,46.35 63.99,45.57 J1.269
  Bottom 0.152: v83.19,33.34 70.17,46.35 v64.77,46.35
DACD7  (via drill 0.2)
  Top 0.152: U6.9 107.59,23.85 98.74,32.7 v82.55,32.7 | v65.41,45.72 64.79,45.1 J1.271
  Bottom 0.152: v82.55,32.7 69.53,45.72 v65.41,45.72
DACD8  (via drill 0.2)
  Top 0.152: U6.10 106.93,23.56 98.42,32.07 v81.92,32.07 | v66.04,45.09 65.59,44.63 J1.273
  Bottom 0.152: v81.92,32.07 68.9,45.09 v66.04,45.09
DACD9  (via drill 0.2)
  Top 0.152: U6.11 106.3,23.24 98.11,31.43 v81.28,31.43 | v66.67,44.45 66.39,44.16 J1.275
  Bottom 0.152: v81.28,31.43 68.26,44.45 v66.67,44.45
GND  (via drill 0.2, 0.25, 0.41, 0.61, 0.64, 0.64 pad 0.61)
  Top 0.254: U$3.9 83.82,41.97 U$3.3
  Top 0.305: ADC1.11 67,28.59 v66.04,27.62 | v66.04,27.62 66.37,27.29 ADC1.5 | v66.04,27.62 65.71,27.29 ADC1.4 | U2.5 85.41,19.34 v85.41,21.27 | ADC1.12 66.37,27.95 v66.04,27.62 | U2.18 84.12,12.7 84.78,12.7 | 84.78,12.7 85.42,12.7 | 85.42,12.7 86.08,12.7 U2.21 | U2.20 85.42,12.7 | U2.19 84.78,12.7 | U2.15 v82.17,12.22 | ADC3.11 17.48,28.59 v16.51,27.62 | v16.51,27.62 16.84,27.29 ADC3.5 | v16.51,27.62 16.18,27.29 ADC3.4 | ADC3.12 16.84,27.95 v16.51,27.62 | ADC2.11 42.24,28.59 v41.27,27.62 | v41.27,27.62 41.6,27.29 ADC2.5 | v41.27,27.62 40.95,27.29 ADC2.4 | ADC2.12 41.6,27.95 v41.27,27.62 | U6.5 110.17,19.34 v110.17,21.27 | U6.18 108.89,12.7 109.55,12.7 | 109.55,12.7 110.19,12.7 | 110.19,12.7 110.85,12.7 U6.21 | U6.20 110.19,12.7 | U6.19 109.55,12.7 | U6.15 v106.93,12.22 | v36.78,77.71 v36.79,77.7 J1.102 | v41.58,77.71 v41.59,77.7 J1.114 | J1.135 v50.38,81.01 | J1.155 v58.38,81.01 | J1.178 v67.18,77.81 | J1.180 v67.98,77.81 | J1.214 41.59,35.49 v40.95,34.85 | v67.93,34.85 67.93,36.24 J1.280 | J1.278 67.19,34.9 v67.14,34.85 | J1.236 50.39,37.62 v50.47,37.71 | J1.256 58.39,37.69 v58.41,37.71 | J1.201 36.82,42.46 v36.82,41.2 | J1.213 v41.58,41.2
  Top 0.406: v62.71,21.27 62.71,22.86 R5.1 | U5.3 v83.82,55.56 U5.6 | U5.7 v83.82,54.29 | U4.5 v93.34,53.02 | v13.18,21.27 13.18,22.86 R41.1 | v37.94,21.27 37.94,22.86 R25.1
  Top 0.61: v69.85,26.35 R14.1 | C23.+ v75.88,11.11 | v89.53,12.7 C58.- | C61.1 v89.53,20.32 | v83.82,54.29 v83.82,55.56 | C11.2 72.61,28.26 v71.12,28.26 69.95,28.26 C8.- | v68.9,20 68.9,18.73 C22.1 | C9.- 59.79,28.26 v60.96,28.26 62.13,28.26 C10.2 | C34.2 79.27,18.41 v78.11,18.41 | v75.88,20 C24.1 | v20.32,26.35 R47.1 | C96.+ v26.35,11.11 | C81.2 23.07,28.26 v21.59,28.26 20.42,28.26 C78.- | v19.37,20 19.37,18.73 C95.1 | C79.- 10.26,28.26 v11.43,28.26 12.6,28.26 C80.2 | v26.35,20 C97.1 | v45.09,26.35 R31.1 | C72.+ v51.12,11.11 | C53.2 47.84,28.26 v46.35,28.26 45.19,28.26 C50.- | v44.13,20 44.13,18.73 C71.1 | C51.- 35.03,28.26 v36.2,28.26 37.36,28.26 C52.2 | v51.12,20 C73.1 | v114.3,12.7 C39.- | C42.1 v114.3,20.32 | C45.2 104.04,18.41 v102.87,18.41
  Bottom 0.406: C18.1 C17.- | 62.71,22.12 C19.+ 61.59,21.91 | 62.71,22.12 C20.1 | 62.71,22.12 v62.71,21.27 | U3.4 84.77,20.64 v85.41,21.27 C32.2 | C12.- C13.- 69.32,24.55 69.85,25.08 v69.85,26.35 | C91.1 C90.- | 13.18,22.12 C92.+ 12.06,21.91 | 13.18,22.12 C93.1 | 13.18,22.12 v13.18,21.27 | C82.- C83.- 19.79,24.55 20.32,25.08 v20.32,26.35 | C67.1 C66.- | 37.94,22.12 C68.+ 36.83,21.91 | 37.94,22.12 C69.1 | 37.94,22.12 v37.94,21.27 | C54.- C55.- 44.55,24.55 45.09,25.08 v45.09,26.35 | U7.4 109.54,20.64 v110.17,21.27 C43.2
  Bottom 0.61: C18.1 64.45,14.92 v63.82,15.56 C6.1 R16.1 | C58.- v89.53,12.7 | C61.1 v89.53,20.32 | C21.- 68.9,21.59 v68.9,20 | C3.2 R9.2 69.95,12.91 v70.17,12.7 | C33.- v78.11,18.41 | C91.1 14.92,14.92 v14.29,15.56 C85.1 R52.1 | C94.- 19.37,21.59 v19.37,20 | C84.2 R51.2 20.42,12.91 v20.64,12.7 | C67.1 39.69,14.92 v39.05,15.56 C57.1 R36.1 | C70.- 44.13,21.59 v44.13,20 | C56.2 R35.2 45.19,12.91 v45.4,12.7 | C39.- v114.3,12.7 | C42.1 v114.3,20.32 | C44.- v102.87,18.41
  other vias: 95.25,68.9 93.98,68.9 93.98,70.17 95.25,70.17 95.25,71.44 93.98,71.44 93.98,72.71 95.25,72.71 93.98,73.98 93.98,75.25 93.98,76.52 93.98,77.79 95.25,77.79 95.25,76.52 92.71,73.98 92.71,72.71 92.71,71.44 91.44,71.44 91.44,72.71 91.44,73.98 85.72,77.79 85.72,76.52 84.45,77.79 84.45,76.52 84.45,75.25 85.72,73.98 85.72,72.71 85.72,71.44 84.45,71.44 84.45,72.71 84.45,73.98 83.19,73.98 83.19,72.71 83.19,71.44 83.19,70.17 83.19,68.9 81.92,68.9 81.92,70.17 81.92,71.44 81.92,72.71 81.92,73.98 80.64,61.91 80.64,62.87 80.64,63.82 82.55,65.09 96.52,62.87 96.52,61.91 96.52,63.82 94.61,65.09 98.27,78.58 97.31,78.58 94.77,79.22 94.77,80.17 88.74,78.58 87.79,78.58 85.25,79.22 85.25,80.17 83.82,56.83 83.82,53.02 93.34,53.98 54.45,12.22 53.66,12.22 53.66,14.45 54.45,14.45 53.66,16.67 53.66,18.26 54.45,16.67 54.45,18.26 53.66,20.48 54.45,20.48 54.45,22.7 53.66,22.7 4.92,12.22 4.13,12.22 4.13,14.45 4.92,14.45 4.13,16.67 4.13,18.26 4.92,16.67 4.92,18.26 4.13,20.48 4.92,20.48 4.92,22.7 4.13,22.7 29.69,12.22 28.89,12.22 28.89,14.45 29.69,14.45 28.89,16.67 28.89,18.26 29.69,16.67 29.69,18.26 28.89,20.48 29.69,20.48 29.69,22.7 28.89,22.7 88.27,40.32 86.68,38.73 88.27,38.73 83.82,44.29
  pour Top: 86.36,12.7 86.36,6.67 85.72,6.03 84.45,6.03 83.5,6.99 83.5,8.26 84.45,9.21 84.45,12.7
  pour $GND (rank 6): 0.64,85.09 0.64,0.64 126.36,0.64 126.36,85.09
  pour Top: 79.69,60.64 83.03,60.64 83.03,57.78 84.61,57.78 84.61,60.96 83.82,60.96 83.82,64.61 83.19,64.61 83.19,68.26 83.82,68.9 84.3,68.9 84.3,70.33 92.87,70.33 92.87,68.9 93.34,68.9 93.98,68.26 93.98,64.45 93.34,64.45 93.34,60.96 92.55,60.96 92.55,57.78 94.14,57.78 94.14,60.64 99.38,60.64 99.38,73.98 95.89,73.98 95.25,74.61 95.25,75.88 95.89,76.52 100.33,76.52 100.33,82.07 92.87,82.07 92.87,76.68 93.34,76.68 93.98,76.04 93.98,75.72 93.34,75.09 89.85,75.09 89.85,73.98 86.36,73.98 85.72,74.61 85.72,75.88 86.36,76.52 89.53,76.52 89.53,82.07 83.34,82.07 83.34,76.68 83.82,76.68 84.45,76.04 84.45,75.72 83.82,75.09 79.69,75.09
  pour Top: 94.14,54.61 92.55,54.61 92.55,46.99 94.14,46.99
  pour Top (rank 6): 84.61,57.47 83.03,57.47 83.03,42.23 84.61,42.23
  pour Top: 53.02,23.18 54.93,23.18 54.93,11.43 53.02,11.43
  pour Top: 3.49,23.18 5.4,23.18 5.4,11.43 3.49,11.43
  pour Top: 28.26,23.18 30.16,23.18 30.16,11.43 28.26,11.43
  pour Top: 111.12,12.7 111.12,6.99 110.17,6.03 108.27,6.03 107.31,6.99 107.31,8.26 109.22,10.16 109.22,12.7
  pour Top: 88.9,41.91 85.72,41.91 85.72,38.1 88.9,38.1
N$1
  Top 0.254: 69.99,24.49 ADC1.8
  Top 0.305: R10.2 69.99,24.49
N$2  (via drill 0.2)
  Top 0.254: 57.45,13.45 ADCOP1.5 | R4.2 C1.2 v56.52,11.43 | R2.1 64.14,17.78 60.64,14.29 v60.64,11.43
  Top 0.406: R4.2 57.45,13.45
  Bottom 0.254: v60.64,11.43 v56.52,11.43
N$3
  Top 0.254: ADCOP1.1 59.38,21.48 | R3.1 59.27,23.07 | C2.1 60.33,23.28 R5.2
  Top 0.406: 59.38,21.48 R3.1 | 59.27,23.07 C2.1
N$4
  Top 0.254: ADCOP1.8 59.38,13.45 | R4.1 C1.1 R6.2
  Top 0.406: 59.38,13.45 R4.1
N$5
  Top 0.254: U2.22 86.74,6.73 85.09,5.08 X5.1
N$7
  Bottom 0.406: R7.1 U1.6 U1.7
N$8
  Bottom 0.406: U1.1 U1.2 R8.1
N$9  (via drill 0.2)
  Top 0.406: ADCOP1.2 58.74,19.65 v58.74,17.46
  Bottom 0.406: v58.74,17.46 R8.2
  Bottom 0.61: R8.2 C6.2 R16.2
N$10
  Top 0.254: ADC1.1 63.04,24.49 R1.2
N$11
  Top 0.254: 64.41,22.9 ADC1.2
  Top 0.305: R2.2 64.03,22.86 64.14,22.86 64.41,22.9
N$12
  Top 0.254: ADCOP1.4 57.45,21.48 | R3.2 57.57,24.55 58.1,25.08 58.95,25.08 | 59.16,25.08 R1.1
  Top 0.406: 57.45,21.48 R3.2 | 58.95,25.08 C2.2 59.16,25.08
N$13
  Top 0.254: 67.67,23.04 ADC1.7
  Top 0.305: R11.2 67.67,23.04
N$14
  Top 0.254: C4.2 R13.2 | 72.06,13.77 ADCOP2.5 70.13,15.6 67.94,17.78 67.94,20.95
  Top 0.406: R13.2 72.06,13.77 | 67.94,20.95 68.05,21.06 R11.1
N$15
  Top 0.254: ADCOP2.1 73.99,21.79 | R12.1 C5.1 R14.2
  Top 0.406: 73.99,21.79 R12.1
N$16
  Top 0.254: R13.1 C4.1 R15.2 | 73.99,13.77 ADCOP2.8
  Top 0.406: R13.1 73.99,13.77
N$17  (via drill 0.41)
  Top 0.406: ADCOP2.2 73.34,19.95 v73.34,18.15
  Bottom 0.406: R7.2 71.65,18.15 v73.34,18.15
  Bottom 0.61: R7.2 C3.1 R9.1
N$18
  Top 0.254: U2.4 86.08,20.99 89.85,24.77 X7.1
N$19
  Top 0.254: X6.1 93.03,8.89 91.76,10.16 88.58,10.16 87.38,11.37 U2.23
N$20
  Top 0.254: C5.2 R12.2 | ADCOP2.4 72.06,21.79 70.6,21.79 70.17,22.23 R10.1
  Top 0.406: R12.2 72.06,21.79
N$21
  Top 0.254: U2.3 86.74,20.38 87.63,21.27 90.17,21.27 92.39,19.05 96.84,19.05 97.47,18.41 X8.1
N$22  (via drill 0.41)
  Top 0.305: 83.5,13.68 U2.17 83.49,12.39 v83.5,12.22
  Top 0.406: C38.2 83.5,11.06 v83.5,12.22
  Bottom 0.406: U3.6 v83.5,12.22
N$23
  $GND 0.152: 68.9,27.3 74.93,27.3 74.93,20.95 77.15,20.95 77.15,14.29 80.33,14.29 80.33,14.92
N$24
  Top 0.254: R15.1 72.07,9.74 71.33,9.74 70.8,9.21 X2.1
N$25
  Top 0.254: R6.1 57.57,8.79 58.42,7.94 X1.1
N$26
  $GND 0.152: 63.18,27.3 44.13,27.3
N$27
  pour Top: 88.42,60.96 88.42,57.78 84.93,57.78 84.93,60.96
N$28
  $GND 0.152: 82.87,47.62 82.87,43.5
N$29
  $GND 0.152: 94.14,60.48 99.69,60.48 99.69,52.7 94.3,52.7 94.3,49.53
N$30
  Top 0.406: U$2.G1 97.58,75.88 R19.2
N$32
  Top 0.406: U$1.G1 88.05,75.88 R17.2
N$33
  $GND 0.152: 94.14,57.63 82.87,57.63
N$34
  Top 0.406: U$1.A3 83.82,65.72 R18.2
N$35
  pour Top: 88.42,70.01 84.61,70.01 84.61,64.61 84.14,64.61 84.14,61.28 88.42,61.28
N$36
  Top 0.254: U6.22 111.51,6.73 109.86,5.08 X3.1
N$37
  pour Top: 92.55,70.01 92.55,64.45 93.03,64.45 93.03,61.28 88.74,61.28 88.74,70.01
N$38
  Top 0.406: U$2.A3 93.34,65.83 R20.1
N$39
  $GND 0.152: 84.61,20.48 84.61,24.92 85.09,25.4 88.9,25.4 89.53,26.04 89.53,28.57 90.49,29.53 99.06,29.53 101.6,26.99 101.6,14.29 105.09,14.29 105.09,14.92
N$40
  $GND 0.152: 94.3,47.62 94.3,46.83 93.03,46.83 | 93.03,46.83 93.03,46.99 | 93.03,46.83 84.77,46.83 84.77,43.5
N$41
  pour Top: 92.23,60.96 92.23,57.78 88.74,57.78 88.74,60.96
N$42
  Top 0.254: U6.4 110.85,20.99 112.39,22.54 117.16,22.54 119.06,24.45 X9.1
N$43
  Top 0.254: X4.1 116.84,8.26 114.94,10.16 112.71,10.16 112.14,10.73 U6.23
N$44
  $GND 0.152: 78.74,81.92 78.74,60.48 | 78.74,60.48 78.74,57.78 | 78.74,57.78 79.06,57.78 | 78.74,57.78 78.74,51.75 82.87,51.75 82.87,49.53 | 82.87,60.48 78.74,60.48
N$45
  Top 0.254: U6.3 111.51,20.38 112.39,21.27 115.89,21.27 116.52,20.64 116.52,15.88 118.43,13.97 X10.1
N$46  (via drill 0.41)
  Top 0.305: 108.27,13.68 U6.17 108.25,12.39 v108.27,12.22
  Top 0.406: C37.2 108.27,11.06 v108.27,12.22
  Bottom 0.406: U7.6 v108.27,12.22
N$47  (via drill 0.2)
  Top 0.254: 32.69,13.45 ADCOP3.5 | R24.2 C46.2 v31.75,11.43 | R22.1 39.37,17.78 35.88,14.29 v35.88,11.43
  Top 0.406: R24.2 32.69,13.45
  Bottom 0.254: v35.88,11.43 v31.75,11.43
N$48
  pour Top: 94.46,60.33 99.38,60.33 99.38,55.09 89.69,55.09 89.69,57.47 94.46,57.47
N$49
  Top 0.406: U5.4 88.27,56.83 C31.1
N$51
  Top 0.254: ADCOP3.1 34.62,21.48 | R23.1 34.51,23.07 | C47.1 35.56,23.28 R25.2
  Top 0.406: 34.62,21.48 R23.1 | 34.51,23.07 C47.1
N$52
  Top 0.254: ADCOP3.8 34.62,13.45 | R24.1 C46.1 R26.2
  Top 0.406: 34.62,13.45 R24.1
N$54
  Top 0.254: ADC2.1 38.28,24.49 R21.2
N$57
  Top 0.254: 39.65,22.9 ADC2.2
  Top 0.305: R22.2 39.27,22.86 39.37,22.86 39.65,22.9
N$59
  Top 0.254: ADCOP3.4 32.69,21.48 | R23.2 32.8,24.55 33.34,25.08 34.19,25.08 | 34.39,25.08 R21.1
  Top 0.406: 32.69,21.48 R23.2 | 34.19,25.08 C47.2 34.39,25.08
N$60
  Top 0.254: C48.2 R30.2 | 47.3,13.77 ADCOP4.5 45.36,15.6 43.18,17.78 43.18,20.95
  Top 0.406: R30.2 47.3,13.77 | 43.18,20.95 43.28,21.06 R28.1
N$62
  Top 0.254: ADCOP4.1 49.23,21.79 | R29.1 C49.1 R31.2
  Top 0.406: 49.23,21.79 R29.1
N$63
  Top 0.254: R30.1 C48.1 R32.2 | 49.23,13.77 ADCOP4.8
  Top 0.406: R30.1 49.23,13.77
N$64
  Top 0.254: C49.2 R29.2 | ADCOP4.4 47.3,21.79 45.84,21.79 45.4,22.23 R27.1
  Top 0.406: R29.2 47.3,21.79
N$65
  Top 0.406: U5.8 79.85,53.02 79.85,56.67 80.01,56.83 U5.5
  pour Top: 79.69,60.33 79.69,56.2 82.71,56.2 82.71,60.33
N$66
  pour Top: 92.23,54.77 92.23,46.99 89.53,46.99 89.53,54.77
N$67
  pour Top: 89.22,55.88 87.63,55.88 87.63,54.93 84.93,54.93 84.93,46.99 89.22,46.99
N$68
  Top 0.254: 45.23,24.49 ADC2.8
  Top 0.305: R27.2 45.23,24.49
N$69
  Top 0.254: 42.9,23.04 ADC2.7
  Top 0.305: R28.2 42.9,23.04
N$70
  Top 0.254: R32.1 47.31,9.74 46.57,9.74 46.04,9.21 X12.1
N$71
  Top 0.254: R26.1 32.8,8.79 33.66,7.94 X11.1
N$72
  Bottom 0.406: R33.1 U8.6 U8.7
N$73
  Bottom 0.406: U8.1 U8.2 37.38,17.45 R34.1
N$74  (via drill 0.2)
  Top 0.406: ADCOP3.2 33.97,19.65 v33.97,17.46
  Bottom 0.406: v33.97,17.46 R34.2
  Bottom 0.61: R34.2 C57.2 R36.2
N$75  (via drill 0.41)
  Top 0.406: ADCOP4.2 48.58,19.95 v48.58,18.15
  Bottom 0.406: R33.2 46.89,18.15 v48.58,18.15
  Bottom 0.61: R33.2 C56.1 R35.1
N$76  (via drill 0.2)
  Top 0.254: 7.92,13.45 ADCOP5.5 | R40.2 C74.2 v6.99,11.43 | R38.1 14.61,17.78 11.11,14.29 v11.11,11.43
  Top 0.406: R40.2 7.92,13.45
  Bottom 0.254: v11.11,11.43 v6.99,11.43
N$77
  Top 0.254: ADCOP5.1 9.86,21.48 | R39.1 9.74,23.07 | C75.1 10.79,23.28 R41.2
  Top 0.406: 9.86,21.48 R39.1 | 9.74,23.07 C75.1
N$78
  Top 0.254: ADCOP5.8 9.86,13.45 | R40.1 C74.1 R42.2
  Top 0.406: 9.86,13.45 R40.1
N$79
  Top 0.254: ADC3.1 13.51,24.49 R37.2
N$80
  Top 0.254: 14.88,22.9 ADC3.2
  Top 0.305: R38.2 14.5,22.86 14.61,22.86 14.88,22.9
N$81
  Top 0.254: ADCOP5.4 7.92,21.48 | R39.2 8.04,24.55 8.57,25.08 9.42,25.08 | 9.63,25.08 R37.1
  Top 0.406: 7.92,21.48 R39.2 | 9.42,25.08 C75.2 9.63,25.08
N$82
  Top 0.254: C76.2 R46.2 | 22.53,13.77 ADCOP6.5 20.6,15.6 18.41,17.78 18.41,20.95
  Top 0.406: R46.2 22.53,13.77 | 18.41,20.95 18.52,21.06 R44.1
N$83
  Top 0.254: ADCOP6.1 24.46,21.79 | R45.1 C77.1 R47.2
  Top 0.406: 24.46,21.79 R45.1
N$84
  Top 0.254: R46.1 C76.1 R48.2 | 24.46,13.77 ADCOP6.8
  Top 0.406: R46.1 24.46,13.77
N$85
  Top 0.254: C77.2 R45.2 | ADCOP6.4 22.53,21.79 21.07,21.79 20.64,22.23 R43.1
  Top 0.406: R45.2 22.53,21.79
N$86
  Top 0.254: 20.46,24.49 ADC3.8
  Top 0.305: R43.2 20.46,24.49
N$87
  Top 0.254: 18.14,23.04 ADC3.7
  Top 0.305: R44.2 18.14,23.04
N$88
  Top 0.254: R48.1 22.54,9.74 21.8,9.74 21.27,9.21 X14.1
N$89
  Top 0.254: R42.1 8.04,8.79 8.89,7.94 X13.1
N$90
  Bottom 0.406: R49.1 U9.6 U9.7
N$91
  Bottom 0.406: U9.1 U9.2 R50.1
N$92  (via drill 0.2)
  Top 0.406: ADCOP5.2 9.21,19.65 v9.21,17.46
  Bottom 0.406: v9.21,17.46 R50.2
  Bottom 0.61: R50.2 C85.2 R52.2
N$93  (via drill 0.41)
  Top 0.406: ADCOP6.2 23.81,19.95 v23.81,18.15
  Bottom 0.406: R49.2 22.12,18.15 v23.81,18.15
  Bottom 0.61: R49.2 C84.1 R51.1
S$1
  $GND 0.152: 109.38,20.32 109.38,22.7 109.86,23.18 116.52,23.18 117.47,24.13 117.47,27.62 118.75,28.89 126.36,28.89
S$2
  $GND 0.152: 38.42,27.3 19.37,27.3
S$3
  $GND 0.152: 13.65,27.3 0.64,27.3
V+
  Top 0.356: J1.101 36.79,84.14 37.59,84.14 | 37.59,84.14 38.42,84.14 38.42,82.46 J1.105 | J1.103 37.59,84.14
  pour Top: 79.69,83.5 36.2,83.5 36.2,85.41 100.33,85.41 100.33,82.39 92.55,82.39 92.55,76.36 93.19,76.36 93.5,76.04 93.5,75.72 93.19,75.41 89.85,75.41 89.85,82.39 83.03,82.39 83.03,76.36 83.66,76.36 83.98,76.04 83.98,75.72 83.66,75.41 79.69,75.41
VDD  (via drill 0.61, 0.64)
  Top 0.356: C8.+ 69.71,30.12 ADC1.9 | C50.+ 44.94,30.12 ADC2.9 | C78.+ 20.18,30.12 ADC3.9
  Top 0.61: C8.+ 69.95,30.16 70.8,30.16 v71.12,30.48 71.44,30.16 72.29,30.16 C11.1 | C50.+ 45.19,30.16 46.04,30.16 v46.35,30.48 46.67,30.16 47.52,30.16 C53.1 | C78.+ 20.42,30.16 21.27,30.16 v21.59,30.48 21.91,30.16 22.76,30.16 C81.1
  other vias: 82.87,40.32 84.45,38.73 82.87,38.73
  pour Top: 85.41,38.1 85.41,41.91 82.23,41.91 82.23,38.1
  pour Route15: 0.32,33.02 82.23,33.02 82.23,41.27 85.41,41.27 85.41,30.48 72.39,30.48 71.75,29.84 70.48,29.84 69.85,30.48 0.32,30.48
VREF1A  (via drill 0.3, 0.41)
  Top 0.305: v65.41,20.95 65.41,22.23 65.08,22.55 ADC1.3 65.09,24.5 65.09,25.72 v64.93,25.88
  Bottom 0.305: v64.93,25.88 65.3,26.25 C12.+
  Bottom 0.406: U1.3 64.78,18.11 65.41,18.73 v65.41,20.95
VREF1B  (via drill 0.3, 0.41)
  Top 0.305: v66.67,20.95 66.67,22.23 67,22.55 ADC1.6 66.99,24.5 66.99,25.72 v67.15,25.88
  Bottom 0.305: C13.+ 67.53,26.25 v67.15,25.88
  Bottom 0.406: U1.5 66.98,18.75 66.67,19.05 v66.67,20.95
VREF2A  (via drill 0.3, 0.41)
  Top 0.305: v40.64,20.95 40.64,22.23 40.31,22.55 ADC2.3 40.32,24.5 40.32,25.72 v40.16,25.88
  Bottom 0.305: v40.16,25.88 40.54,26.25 C54.+
  Bottom 0.406: U8.3 40.02,18.11 40.64,18.73 v40.64,20.95
VREF2B  (via drill 0.3, 0.41)
  Top 0.305: v41.91,20.95 41.91,22.23 42.24,22.55 ADC2.6 42.23,24.5 42.23,25.72 v42.39,25.88
  Bottom 0.305: C55.+ 42.76,26.25 v42.39,25.88
  Bottom 0.406: U8.5 42.22,18.75 41.91,19.05 v41.91,20.95
VREF3A  (via drill 0.3, 0.41)
  Top 0.305: v15.88,20.95 15.88,22.23 15.54,22.55 ADC3.3 15.56,24.5 15.56,25.72 v15.4,25.88
  Bottom 0.305: v15.4,25.88 15.77,26.25 C82.+
  Bottom 0.406: U9.3 15.25,18.11 15.88,18.73 v15.88,20.95
VREF3B  (via drill 0.3, 0.41)
  Top 0.305: v17.14,20.95 17.14,22.23 17.48,22.55 ADC3.6 17.46,24.5 17.46,25.72 v17.62,25.88
  Bottom 0.305: C83.+ 18,26.25 v17.62,25.88
  Bottom 0.406: U9.5 17.45,18.75 17.14,19.05 v17.14,20.95

## Text on the board
Document: Geoffrey Ji / 10/31/13 | High Speed AD/DA Board V2